# Altium schematic sheet PAGE 06-Copper Ports.SchDoc
size 416 x 264 mm; DocumentNumber: 6; SheetNumber: 6; PageSetup: Record=PageOptions|CenterHorizontal=True|CenterVertical=True|PrintScale=1.02|XCorrection=1.00|YCorrection=1.00|PrintKind=0|BorderSize=5000000|LeftOffset=0|BottomOffset=0|Orientation=2|PaperLength=1000|PaperWidth=1000|Scale=100|PaperSource=15|PrintQuality=600|MediaType=1|DitherType=10|PrintScaleMode=1|PaperKind=11x17|PaperIndex=17; Designer: Xuelu Li; DocumentFullPathAndName: //depot_np_hweng_boards/ung_hweng/UNG_8017_EVB-USB5926/
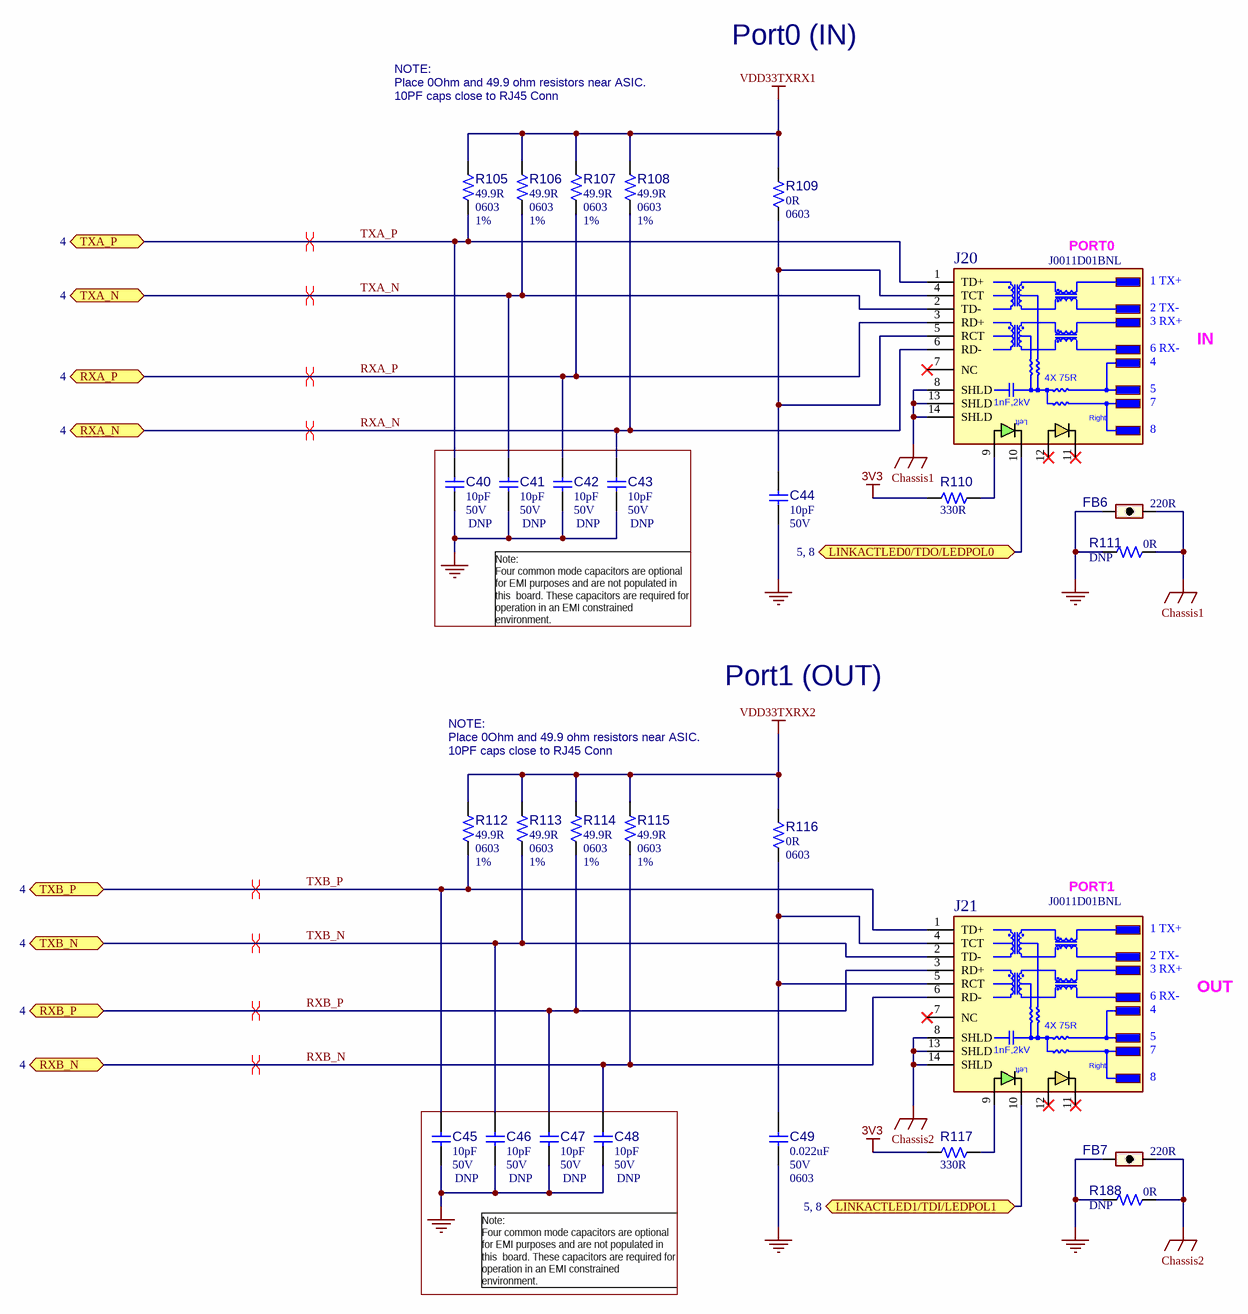
[diagram p0: PAGE 06-Copper Ports.SchDoc]

## Parts
?  (no value)  (graphical)
C40  value 10pF  Voltage: 50V  Populated: DNP  [CAP_C_0603]  (hidden comment: Capacitor NP)
C41  value 10pF  Voltage: 50V  Populated: DNP  [CAP_C_0603]  (hidden comment: Capacitor NP)
C42  value 10pF  Voltage: 50V  Populated: DNP  [CAP_C_0603]  (hidden comment: Capacitor NP)
C43  value 10pF  Voltage: 50V  Populated: DNP  [CAP_C_0603]  (hidden comment: Capacitor NP)
C44  value 10pF  Voltage: 50V  [CAP_C_0603]  (hidden comment: Capacitor NP)
C45  value 10pF  Voltage: 50V  Populated: DNP  [CAP_C_0603]  (hidden comment: Capacitor NP)
C46  value 10pF  Voltage: 50V  Populated: DNP  [CAP_C_0603]  (hidden comment: Capacitor NP)
C47  value 10pF  Voltage: 50V  Populated: DNP  [CAP_C_0603]  (hidden comment: Capacitor NP)
C48  value 10pF  Voltage: 50V  Populated: DNP  [CAP_C_0603]  (hidden comment: Capacitor NP)
C49  value 0.022uF  Voltage: 50V  Package: 0603  [CAP_C_0603]  (hidden comment: Capacitor NP)
FB6  value 220R  [IND_C_0603]  (hidden comment: Ferrite Bead)
FB7  value 220R  [IND_C_0603]  (hidden comment: Ferrite Bead)
J20  value J0011D01BNL  [J00-0045NL_RJ45_connector]  (hidden comment: RJ45 J00-0045NL)
J21  value J0011D01BNL  [J00-0045NL_RJ45_connector]  (hidden comment: RJ45 J00-0045NL)
R105  value 49.9R  Package: 0603  Tolerance: 1%  [RES_C_0603]  (hidden comment: Resistor)
R106  value 49.9R  Package: 0603  Tolerance: 1%  [RES_C_0603]  (hidden comment: Resistor)
R107  value 49.9R  Package: 0603  Tolerance: 1%  [RES_C_0603]  (hidden comment: Resistor)
R108  value 49.9R  Package: 0603  Tolerance: 1%  [RES_C_0603]  (hidden comment: Resistor)
R109  value 0R  Package: 0603  [RES_C_0603]  (hidden comment: Resistor)
R110  value 330R  [RES_C_0603]  (hidden comment: Resistor)
R111  value 0R  Populated: DNP  [RES_C_0603]  (hidden comment: Resistor)
R112  value 49.9R  Package: 0603  Tolerance: 1%  [RES_C_0603]  (hidden comment: Resistor)
R113  value 49.9R  Package: 0603  Tolerance: 1%  [RES_C_0603]  (hidden comment: Resistor)
R114  value 49.9R  Package: 0603  Tolerance: 1%  [RES_C_0603]  (hidden comment: Resistor)
R115  value 49.9R  Package: 0603  Tolerance: 1%  [RES_C_0603]  (hidden comment: Resistor)
R116  value 0R  Package: 0603  [RES_C_0603]  (hidden comment: Resistor)
R117  value 330R  [RES_C_0603]  (hidden comment: Resistor)
R188  value 0R  Populated: DNP  [RES_C_0603]  (hidden comment: Resistor)

## Ports
LINKACTLED0/TDO/LEDPOL0 (bidir, see 5, 8), LINKACTLED1/TDI/LEDPOL1 (bidir, see 5, 8), RXA_N (bidir, see 4), RXA_P (bidir, see 4), RXB_N (bidir, see 4), RXB_P (bidir, see 4), TXA_N (bidir, see 4), TXA_P (bidir, see 4), TXB_N (bidir, see 4), TXB_P (bidir, see 4)

## Nets
3V3: R110.1 R117.1
Chassis1: FB6.2 J20.8(SHLD) J20.13(SHLD) J20.14(SHLD) R111.2
Chassis2: FB7.2 J21.8(SHLD) J21.13(SHLD) J21.14(SHLD) R188.2
GND: C40.1 C41.1 C42.1 C43.1 C44.1 C45.1 C46.1 C47.1 C48.1 C49.1 FB6.1 FB7.1 R111.1 R188.1
VDD33TXRX1: R105.2 R106.2 R107.2 R108.2 R109.2
VDD33TXRX2: R112.2 R113.2 R114.2 R115.2 R116.2
LINKACTLED0/TDO/LEDPOL0: J20.10(Cy) ; port LINKACTLED0/TDO/LEDPOL0
LINKACTLED1/TDI/LEDPOL1: J21.10(Cy) ; port LINKACTLED1/TDI/LEDPOL1
RXA_N: C43.2 J20.6(RD-) R108.1 ; port RXA_N
RXA_P: C42.2 J20.3(RD+) R107.1 ; port RXA_P
RXB_N: C48.2 J21.6(RD-) R115.1 ; port RXB_N
RXB_P: C47.2 J21.3(RD+) R114.1 ; port RXB_P
TXA_N: C41.2 J20.2(TD-) R106.1 ; port TXA_N
TXA_P: C40.2 J20.1(TD+) R105.1 ; port TXA_P
TXB_N: C46.2 J21.2(TD-) R113.1 ; port TXB_N
TXB_P: C45.2 J21.1(TD+) R112.1 ; port TXB_P
NetC44_2: C44.2 J20.4(TCT) J20.5(RCT) R109.1
NetC49_2: C49.2 J21.4(TCT) J21.5(RCT) R116.1
NetJ20_9: J20.9(Ay) R110.2
NetJ21_9: J21.9(Ay) R117.2

Not connected (* = marked no-connect by the designer): J20 7(NC)* 11(Ag)* 12(Cg)*; J21 7(NC)* 11(Ag)* 12(Cg)*

## Layout directives
differential pair: RXA_N, RXA_P, RXB_N, RXB_P, TXA_N, TXA_P, TXB_N, TXB_P

## Notes on the sheet
- Port0 (IN)
- NOTE:
  Place 0Ohm and 49.9 ohm resistors near ASIC.
  10PF caps close to RJ45 Conn
- (near J20) PORT0
- IN
- Note:
  Four common mode capacitors are optional for EMI purposes and are not populated in this  board. These capacitors are required for operation in an EMI constrained environment.
- Port1 (OUT)
- (near J21) PORT1
- OUT
- Microchip Technology, Inc.
  USB/Network Group - UNG
  www.Microchip.com
- Designed with
- Altium.com <http://go.altium.com/MicrochipLandingPage_Evaluation.html>
- Page Title:
- Project Name:
- Description:
- PN:
- Size:
- B
- Date:
- Designer:
- Sheet
- of
- Rev
- (in symbol CON1858) 1 TX+; 2 TX-; 3 RX+; 6 RX-; 4X 75R; 1nF,2kV; Left; Right

## Library data of the parts
? = Title Block B_UNG1_Altium
C40-C43 C45-C48 = CAP0142: Capacitor; Manufacturer 1: KEMET; Manufacturer Part Number 1: C0603C100J5GACTU; Description_: CAP CER 10pF 50V 5% NP0 SMD 0603; Dev Tools Status: Production; Tolerance: 5%; Temperature Coeffcient: NP0; Type: Ceramic; MCHP-ID: CAP0142; Package: 0603; Revision: 1; Symbol: Capacitor NP; Status: MCL Design; ComponentLink1URL: https://chn-vm-apps.microchip.com/mchprepo/parts/Datasheets/KEM_C1002_X7R_SMD.pdf; ComponentLink1Description: SVN Datasheet; ComponentLink2URL: C:\ALTIUM_WORK\00001_MCHP-CDB\Datasheets\KEM_C1002_X7R_SMD.pdf; ComponentLink2Description: Local Datasheet; ComponentLink3URL: C:\ALTIUM_WORK\00001_MCHP-CDB\Library\LibraryRefs\Capacitor NP.SchLib; ComponentLink3Description: Open Symbol; ComponentLink4URL: C:\ALTIUM_WORK\00001_MCHP-CDB\Library\Footprints\CAP_C_0603.PcbLib; ComponentLink4Description: Open Footprint; ComponentLink5Description: Open Footprint 2; ComponentLink6Description: Open Footprint 3; ComponentLink7Description: Open Footprint 4; Operating Temperature: -55C to +125C; Category: Capacitor; Manufacturer 2: Murata; Manufacturer Part Number 2: GRM1885C1H100JA01D; Manufacturer 3: TDK; Manufacturer Part Number 3: C1608C0G1H100J; Manufacturer 4: KEMET; Manufacturer Part Number 4: C0603C100J5GAC; Supplier 1: Digi-Key; Supplier Part Number 1: 399-1049-2-ND; Supplier 2: Digi-Key; Supplier Part Number 2: 490-1403-2-ND; Supplier 3: Digi-Key; Supplier Part Number 3: 490-1403-1-ND; Supplier 4: Digi-Key; Supplier Part Number 4: 445-6852-1-ND; Supplier 5: KEMET; Supplier Part Number 5: C0603C100J5GAC; Quantity Override: 1
C44 = CAP0142: Capacitor; Manufacturer 1: KEMET; Manufacturer Part Number 1: C0603C100J5GACTU; Description_: CAP CER 10pF 50V 5% NP0 SMD 0603; Dev Tools Status: Production; Tolerance: 5%; Temperature Coeffcient: NP0; Type: Ceramic; Populated: Yes; MCHP-ID: CAP0142; Package: 0603; Revision: 1; Symbol: Capacitor NP; Status: MCL Design; ComponentLink1URL: https://chn-vm-apps.microchip.com/mchprepo/parts/Datasheets/KEM_C1002_X7R_SMD.pdf; ComponentLink1Description: SVN Datasheet; ComponentLink2URL: C:\ALTIUM_WORK\00001_MCHP-CDB\Datasheets\KEM_C1002_X7R_SMD.pdf; ComponentLink2Description: Local Datasheet; ComponentLink3URL: C:\ALTIUM_WORK\00001_MCHP-CDB\Library\LibraryRefs\Capacitor NP.SchLib; ComponentLink3Description: Open Symbol; ComponentLink4URL: C:\ALTIUM_WORK\00001_MCHP-CDB\Library\Footprints\CAP_C_0603.PcbLib; ComponentLink4Description: Open Footprint; ComponentLink5Description: Open Footprint 2; ComponentLink6Description: Open Footprint 3; ComponentLink7Description: Open Footprint 4; Operating Temperature: -55C to +125C; Category: Capacitor; Manufacturer 2: Murata; Manufacturer Part Number 2: GRM1885C1H100JA01D; Manufacturer 3: TDK; Manufacturer Part Number 3: C1608C0G1H100J; Manufacturer 4: KEMET; Manufacturer Part Number 4: C0603C100J5GAC; Supplier 1: Digi-Key; Supplier Part Number 1: 399-1049-2-ND; Supplier 2: Digi-Key; Supplier Part Number 2: 490-1403-2-ND; Supplier 3: Digi-Key; Supplier Part Number 3: 490-1403-1-ND; Supplier 4: Digi-Key; Supplier Part Number 4: 445-6852-1-ND; Supplier 5: KEMET; Supplier Part Number 5: C0603C100J5GAC; Quantity Override: 1
C49 = CAP0625: Capacitor; Manufacturer 1: AVX; Manufacturer Part Number 1: 06035C223JAT2A; Description_: CAP CER 0.022uF 50V 5% X7R SMD 0603; Dev Tools Status: Production; Tolerance: 5%; Temperature Coeffcient: X7R; Type: Ceramic; Populated: YES; MCHP-ID: CAP0625; Revision: 1; Symbol: Capacitor NP; Status: MCL Design; ComponentLink1URL: https://chn-vm-apps.microchip.com/mchprepo/parts/Datasheets/smccp.pdf; ComponentLink1Description: SVN Datasheet; ComponentLink2URL: C:\ALTIUM_WORK\00001_MCHP-CDB\Datasheets\smccp.pdf; ComponentLink2Description: Local Datasheet; ComponentLink3URL: C:\ALTIUM_WORK\00001_MCHP-CDB\Library\LibraryRefs\Capacitor NP.SchLib; ComponentLink3Description: Open Symbol; ComponentLink4URL: C:\ALTIUM_WORK\00001_MCHP-CDB\Library\Footprints\CAP_C_0603.PcbLib; ComponentLink4Description: Open Footprint; ComponentLink5Description: Open Footprint 2; ComponentLink6Description: Open Footprint 3; ComponentLink7Description: Open Footprint 4; Operating Temperature: -55C to +125C; Category: Capacitor; Supplier 1: Digi-Key; Supplier Part Number 1: 478-3722-2-ND; Quantity Override: 1
FB6 FB7 = IND1025: Manufacturer 1: Murata; Manufacturer Part Number 1: BLM18AG221SN1D; Description_: FERRITE 500mA 220R SMD 0603; Dev Tools Status: Production; Owner: Sompoch Loboonlert; RMS Current: 500ma; Test Frequency: 100 MHz; Populated: YES; MCHP-ID: IND1025; Revision: 1; Symbol: Ferrite Bead; Status: MCL Design; ComponentLink1URL: https://chn-vm-apps.microchip.com/mchprepo/parts/Datasheets/L0110S0100BLM18A.pdf; ComponentLink1Description: Datasheet; Package: SMD; Type: Ferrite Bead; Category: Inductor; Supplier 1: Digi-Key; Supplier Part Number 1: 490-1012-1-ND; Quantity Override: 1
J20 J21 = CON1858: Manufacturer 1: Pulse Electronics Network; Description_: CON MODULAR JACK RJ45 100 2xLEDS SHIELD TH R/A; Dev Tools Status: Production; Owner: Sam Charles; Populated: YES; MCHP-ID: CON1858; Revision: 1; Symbol: RJ45 J00-0045NL; Status: MCL Design; ComponentLink1URL: https://chn-vm-apps.microchip.com/mchprepo/parts/Datasheets/J403.pdf; ComponentLink1Description: SVN Datasheet; ComponentLink2URL: C:\ALTIUM_WORK\00001_MCHP-CDB\Datasheets\J403.pdf; ComponentLink2Description: Local Datasheet; ComponentLink3URL: C:\ALTIUM_WORK\00001_MCHP-CDB\Library\LibraryRefs\RJ45 J00-0045NL.SchLib; ComponentLink3Description: Open Symbol; ComponentLink4URL: C:\ALTIUM_WORK\00001_MCHP-CDB\Library\Footprints\J00-0045NL_RJ45_connector.PcbLib; ComponentLink4Description: Open Footprint; ComponentLink5Description: Open Footprint 2; ComponentLink6Description: Open Footprint 3; ComponentLink7Description: Open Footprint 4; Type: Modular; Category: Connector; Manufacturer Part Number 1: J0011D01BNL; Supplier 1: Digi-Key; Supplier Part Number 1: 553-1483-ND; Quantity Override: 1
R105-R108 R112-R115 = RES1188: Manufacturer 1: Panasonic; Manufacturer Part Number 1: ERJ-3EKF49R9V; Description_: RES TKF 49.9R 1% 1/10W SMD 0603; Voltage: 75V; Temperature Coeffcient: 100ppm/C; Power: 1/10W; Owner: Adrian T (M91397); Populated: Yes; MCHP-ID: RES1188; Revision: 0; Status: Production; ComponentLink1URL: https://chn-vm-apps.microchip.com/mchprepo/parts/Datasheets/AOA0000CE2.pdf; ComponentLink1Description: Datasheet; Operating Temperature: -55C to +155C; Category: Resistor; Type: RES SMD; Composition: TKF; Supplier 1: Digi-Key; Supplier Part Number 1: P49.9HCT-ND; Quantity Override: 1
R109 R116 = RSMT0001: Manufacturer 1: NIC Components; Manufacturer Part Number 1: NRC06Z0TRF; Description_: RES TKF 0R 1/10W SMD 0603; Power: 1/10W; Populated: Yes; MCHP-ID: RSMT0001; Revision: 2; Status: Production; ComponentLink1URL: https://chn-vm-apps.microchip.com/mchprepo/parts/Datasheets/nrc.pdf; ComponentLink1Description: Datasheet; Operating Temperature: -55C to +155C; Category: Resistor; Type: RES SMD; Composition: TKF; Manufacturer 2: Panasonic; Manufacturer Part Number 2: ERJ-3GSY0R00V; Manufacturer 3: Panasonic; Manufacturer Part Number 3: ERJ-3GEY0R00V; Manufacturer 4: Stackpole Electronics Inc; Manufacturer Part Number 4: RMCF0603ZT0R00; Manufacturer 5: Vishay; Manufacturer Part Number 5: CRCW06030000Z0EA; Manufacturer 6: Stackpole Electronics Inc; Manufacturer Part Number 6: RMCF 1/16 0 R; Manufacturer 7: Yageo; Manufacturer Part Number 7: RC0603JR-070RL; Manufacturer 8: KOA Speer; Manufacturer Part Number 8: RK73Z1JTTP; Manufacturer 9: ROHM; Manufacturer Part Number 9: MCR03EZPJ000; Supplier 1: NIC Components; Supplier Part Number 1: NRC06Z0TRF; Supplier 2: Digi-Key; Supplier Part Number 2: P0.0GTR-ND; Supplier 3: Digi-Key; Supplier Part Number 3: RMCF0603ZT0R00TR-ND; Supplier 4: Digi-Key; Supplier Part Number 4: RMCF0603ZT0R00CT-ND; Supplier 5: Digi-Key; Supplier Part Number 5: 541-0.0GCT-ND; Supplier 6: Digi-Key; Supplier Part Number 6: RMCF1/160RTR-ND; Supplier 7: Digi-Key; Supplier Part Number 7: 311-0.0GRCT-ND; Supplier 8: KOA Speer; Supplier Part Number 8: RK73Z1JTTP; Supplier 9: Digi-Key; Supplier Part Number 9: RHM0.0GCT-ND; Quantity Override: 1
R110 R117 = RES0195: Manufacturer 1: ROHM; Manufacturer Part Number 1: MCR03EZPJ331; Tolerance: 5%; Description_: RES TKF 330R 5% 1/10W SMD 0603; Dev Tools Status: Production; Voltage: 50V; Temperature Coeffcient: 100ppm/C; Power: 1/10W; Populated: Yes; MCHP-ID: RES0195; Package: 0603; Revision: 1; Symbol: Resistor; Status: MCL Design; ComponentLink1URL: https://chn-vm-apps.microchip.com/mchprepo/parts/Datasheets/mcr_a.pdf; ComponentLink1Description: SVN Datasheet; ComponentLink2URL: C:\ALTIUM_WORK\00001_MCHP-CDB\Datasheets\mcr_a.pdf; ComponentLink2Description: Local Datasheet; ComponentLink3URL: C:\ALTIUM_WORK\00001_MCHP-CDB\Library\LibraryRefs\Resistor.SchLib; ComponentLink3Description: Open Symbol; ComponentLink4URL: C:\ALTIUM_WORK\00001_MCHP-CDB\Library\Footprints\RES_C_0603.PcbLib; ComponentLink4Description: Open Footprint; ComponentLink5Description: Open Footprint 2; ComponentLink6Description: Open Footprint 3; ComponentLink7Description: Open Footprint 4; Operating Temperature: -55C to +155C; Category: Resistor; Type: RES SMD; Composition: TKF; Manufacturer 2: Stackpole Electronics Inc; Manufacturer Part Number 2: RMCF0603JT330R; Manufacturer 3: Yageo; Manufacturer Part Number 3: 9C06031A3300JLHFT; Supplier 1: Digi-Key; Supplier Part Number 1: RHM330GCT-ND; Supplier 2: Digi-Key; Supplier Part Number 2: RMCF0603JT330RCT-ND; Supplier 3: Digi-Key; Supplier Part Number 3: 311-330GDKR-ND; Quantity Override: 1
R111 R188 = RES2360: Manufacturer 1: Panasonic Electronic Components; Manufacturer Part Number 1: ERJ-3GEY0R00V; Description_: RES TKF 0R 1/10W AEC-Q200 SMD 0603; Dev Tools Status: Design; Circuit Type: Isolated; Power: 1/10W; Owner: Steve Dziaba; MCHP-ID: RES2360; Package: 0603; Revision: A; Symbol: Resistor; Status: MCL Design; ComponentLink1URL: https://chn-vm-apps.microchip.com/mchprepo/parts/Datasheets/ERJ-3GEY0R00V.pdf; ComponentLink1Description: SVN Datasheet; ComponentLink2URL: C:\ALTIUM_WORK\00001_MCHP-CDB\Datasheets\ERJ-3GEY0R00V.pdf; ComponentLink2Description: Local Datasheet; ComponentLink3URL: C:\ALTIUM_WORK\00001_MCHP-CDB\Library\LibraryRefs\Resistor.SchLib; ComponentLink3Description: Open Symbol; ComponentLink4URL: C:\ALTIUM_WORK\00001_MCHP-CDB\Library\Footprints\RES_C_0603.PcbLib; ComponentLink4Description: Open Footprint; ComponentLink5Description: Open Footprint 2; ComponentLink6Description: Open Footprint 3; ComponentLink7Description: Open Footprint 4; Category: Resistor; Type: RES SMD; Composition: TKF; Manufacturer 2: Vishay; Manufacturer Part Number 2: CRCW06030000Z0EB; Supplier 1: Digi-Key; Supplier Part Number 1: P0.0GCT-ND; Supplier 2: Digi-Key; Supplier Part Number 2: 541-2968-1-ND; Quantity Override: 1